# EAGLE design V1_HUB (EAGLE 6.4)
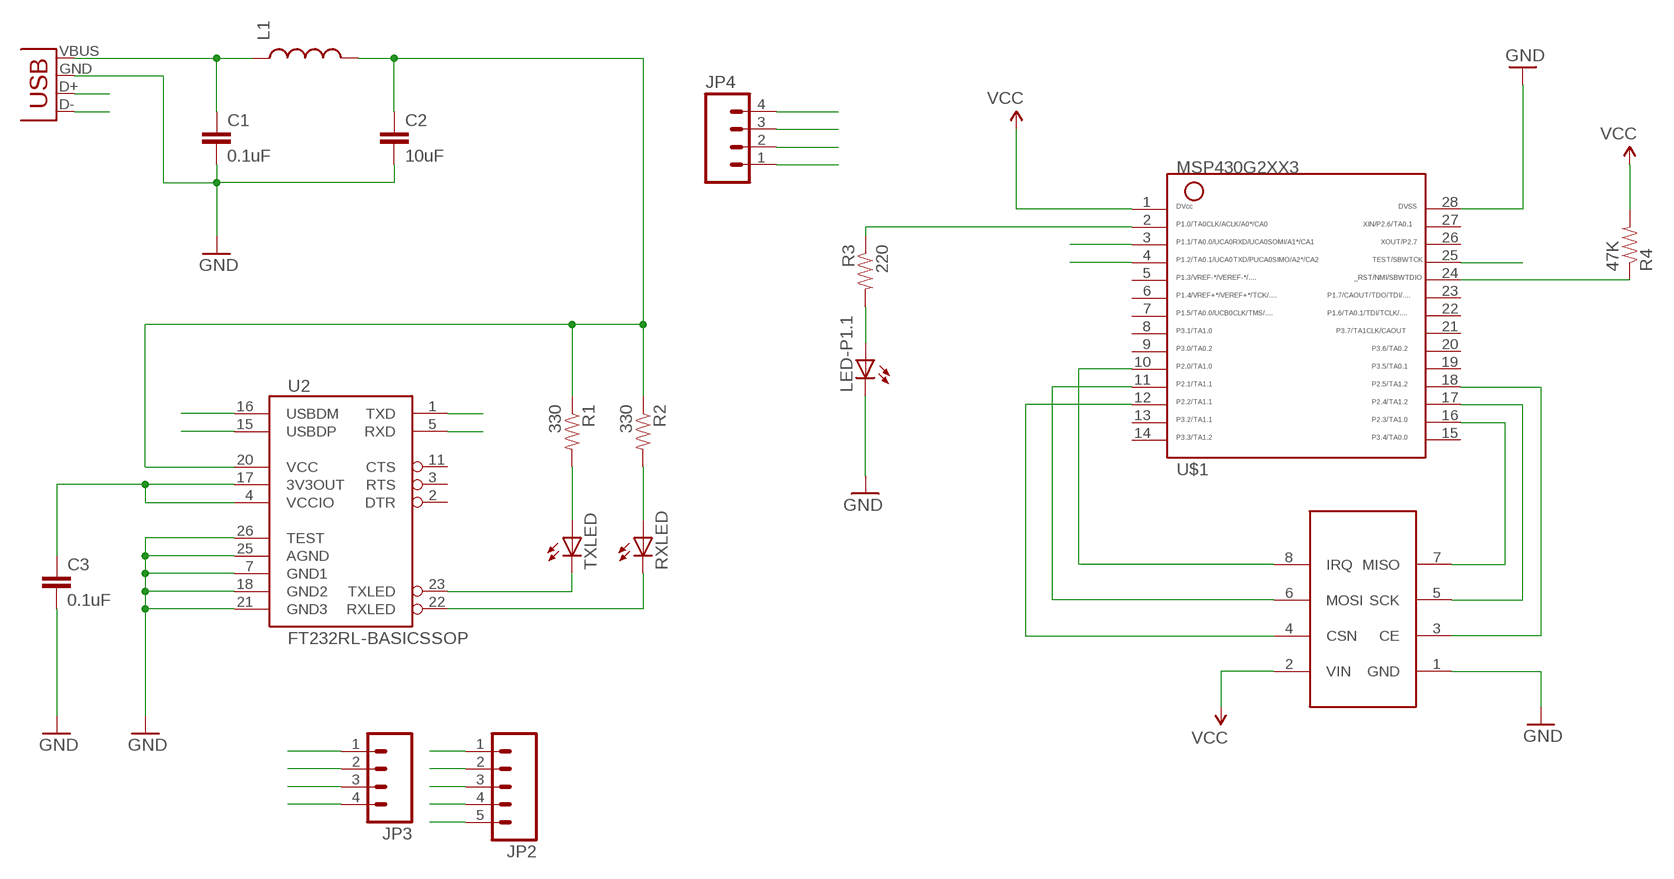
[diagram p0: schematic, sheet 1]

## Parts
C1  0.1uF  CAP0805  [0805]
C2  10uF  CAP0805  [0805]
C3  0.1uF  CAP0805  [0805]
JP1  USB-B  USB-A-H  [USB-A-H]
JP2  M05LOCK  [1X05_LOCK]
JP3  M04LOCK  [1X04_LOCK]
JP4  M04LOCK  [1X04_LOCK]
L1  INDUCTOR0805  [0805]
LED-P1.1  LED0805  [LED-0805]
R1  330  RESISTOR0805-RES  [0805]
R2  330  RESISTOR0805-RES  [0805]
R3  220  RESISTOR0805-RES  [0805]
R4  47K  RESISTOR0805-RES  [0805]
RXLED  LED0805  [LED-0805]
TXLED  LED0805  [LED-0805]
U1  NRF24L01-4X2  [NRF24L01-4X2]
U2  FT232RL-BASICSSOP  [SSOP28DB]
U$1  MSP430G2553  G2XX3---PW28  [PW28]

## Nets
5V: C2.1 JP2.5 L1.2 R1.1 R2.1 U2.20(VCC)
GND: C1.2 C2.2 C3.2 JP1.GND(VBUS) JP2.1 JP3.1 JP4.1 LED-P1.1.C U1.1(GND) U2.7(GND1) U2.18(GND2) U2.21(GND3) U2.25(AGND) U2.26(TEST) U$1.28
N$1: U1.3(CE) U$1.18
N$2: U1.5(SCK) U$1.17
N$3: U1.7(MISO) U$1.16
N$4: R3.1 U$1.2
N$5: U1.6(MOSI) U$1.11
N$6: U1.4(CSN) U$1.12
N$7: U1.8(IRQ) U$1.10
N$8: LED-P1.1.A R3.2
N$10: R1.2 TXLED.A
N$13: R2.2 RXLED.A
N$14: RXLED.C U2.22(RXLED)
N$15: TXLED.C U2.23(TXLED)
N$16: C1.1 JP1.VBUS(GND) L1.1
RESET: JP4.2 R4.1 U$1.24
RX: JP2.3 JP3.3 U2.5(RXD) U$1.4
TEST: JP4.3 U$1.25
TX: JP2.2 JP3.2 U2.1(TXD) U$1.3
USBDM: JP1.D-(D+) U2.16(USBDM)
USBDP: JP1.D+(D-) U2.15(USBDP)
VCC: C3.1 JP2.4 JP3.4 JP4.4 R4.2 U1.2(VIN) U2.4(VCCIO) U2.17(3V3OUT) U$1.1
Unconnected: U2.2(DTR) U2.3(RTS) U2.11(CTS) U$1.5 U$1.6 U$1.7 U$1.8 U$1.9 U$1.13 U$1.14 U$1.15 U$1.19 U$1.20 U$1.21 U$1.22 U$1.23 U$1.26 U$1.27

## Library data of the parts
C1-C3 = SparkFun-Capacitors:CAP: Capacitor Standard 0603 ceramic capacitor, and 0.1" leaded capacitor.
JP1 = SparkFun-Connectors:USB: USB Connectors USB-B-PTH is fully proven SKU : PRT-00139/CONN-08278 USB-miniB is fully proven SKU : PRT-00587 USB-A-PCB is untested. USB-A-H is throughly reviewed, but untested. Spark Fun Electronics SKU : PRT-00437 USB-B-SMT is throughly reviewed, but untested. Needs silkscreen touching up. USB-A-S has not been used/tested USB-MB-H has not been used/tested USB-MICROB has been used. CONN-09505
JP2 = SparkFun-Connectors:M05: Header 5 Standard 5-pin 0.1" header. Use with straight break away headers (SKU : PRT-00116), right angle break away headers (PRT-00553), swiss pins (PRT-00743), machine pins (PRT-00117), and female headers (PRT-00115). Molex polarized connector foot print use with SKU : PRT-08230 with associated crimp pins and housings.
JP3 JP4 = SparkFun-Connectors:M04: Header 4 Standard 4-pin 0.1" header. Use with straight break away headers (SKU : PRT-00116), right angle break away headers (PRT-00553), swiss pins (PRT-00743), machine pins (PRT-00117), and female headers (PRT-00115). Molex polarized connector foot print use with SKU : PRT-08231 with associated crimp pins and housings. 1MM SMD Version SKU: PRT-10208
L1 = SparkFun-Passives:INDUCTOR: Inductors Basic Inductor/Choke - 0603 and 1206. Footprints are not proven and vary greatly between part numbers.
LED-P1.1 RXLED TXLED = custom:LED: SMD LEDs 0603- DIO 0805- DIO 1206- DIO
R1 R2 = SparkFun-Passives:RESISTOR: Resistor Basic schematic elements and footprints for 0603, 1206, and PTH resistors.
R3 R4 = SparkFun-Resistors:RESISTOR: Resistor Basic schematic elements and footprints for 0603, 1206, and PTH resistors.
U1 = untitled:NRF24L01-4X2
U2 = SparkFun-DigitalIC:FT232RL-BASIC: USB UART This is the simplified version of the FT232RL unit. Only what you need, nothing you don't. Spark Fun Electronics SKU : COM-00650
U$1 = TI_MSP430_v16:G2XX3---PW28: MSP430G2XX1 TSSOP (PW) 28 Pin Package

## Board
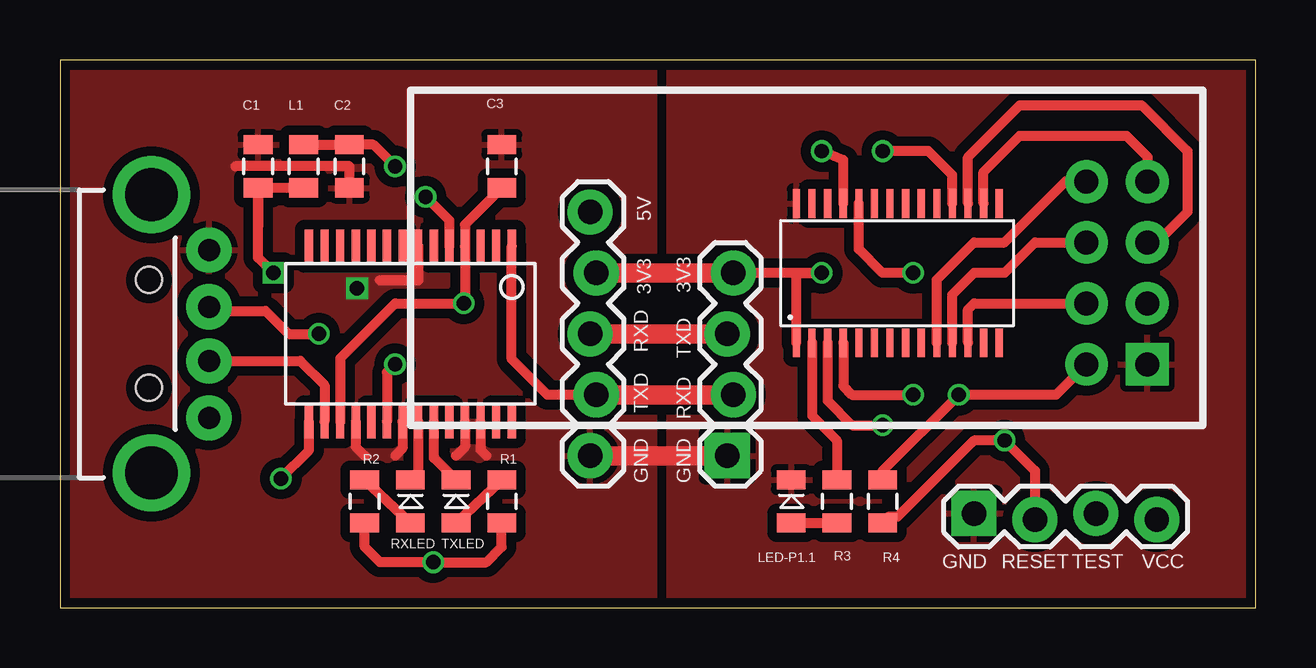
[diagram p1: board, top side]
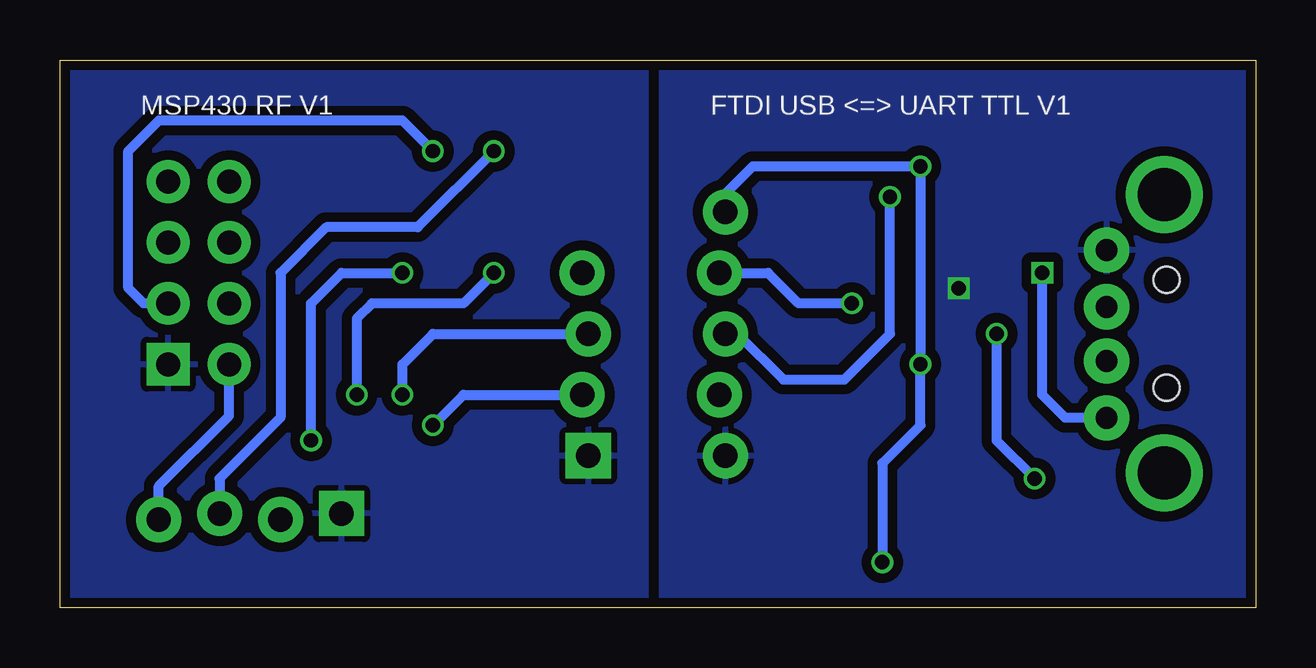
[diagram p2: board, bottom side, seen from below]

Size 49.84 x 22.85 mm. Coordinates in mm from the lower left corner, seen from the top.
Outline: 0,22.85 0,0 49.84,0 49.84,22.85 0,22.85
Copper layers (1*2*15*16): Top 0.035mm / dielectric 0.2mm / layer 2 0.0175mm / dielectric 1.1mm / layer 15 0.0175mm / dielectric 0.2mm / Bottom 0.035mm
Design rules "SeeedStudio_DRU_no_angle_20130527": minimum track width 6mil, minimum drill 12mil, track to track 6mil, track to pad 6mil, pad to pad 6mil, via to via 6mil, smd to smd 0mil, copper to edge 10mil, drill to drill 10mil, minimum pad ring 6mil, minimum via ring 6mil, stop-mask expansion 2mil, vias tented up to drill 25mil, thermal gap 10mil

### Footprints (pad centres in the part's own frame; a part is rotated, then mirrored left to right if it is on the bottom)
0805 = smd 0.8 x 1.2: 1 -0.9,0; 2 0.9,0
USB-A-H = drill 0.914 pad 1.88: D+ 2.4,1.127; D- 2.4,-1.127; GND 2.4,3.5; VBUS 2.4,-3.5 | drill 2.2: GND2 0,-5.8; GND3 0,5.8 | hole 1.1: -0.1,2.25; -0.1,-2.25
1X05_LOCK = drill 1.016 pad 1.88: 1 0,0.127; 2 2.54,-0.127; 3 5.08,0.127; 4 7.62,-0.127; 5 10.16,0.127
1X04_LOCK = drill 1.016 pad 1.88 square: 1 0,0.127 | drill 1.016 pad 1.88: 2 2.54,-0.127; 3 5.08,0.127; 4 7.62,-0.127
LED-0805 = smd 0.8 x 1.2: A -0.9,0; C 0.9,0
NRF24L01-4X2 = drill 1 pad 1.778 square: 1 -11.67,3.81 | drill 1 pad 1.778: 2 -9.13,3.81; 3 -11.67,1.27; 4 -9.13,1.27; 5 -11.67,-1.27; 6 -9.13,-1.27; 7 -11.67,-3.81; 8 -9.13,-3.81
SSOP28DB = smd 0.348 x 1.397: 1 -4.225,-3.656; 2 -3.575,-3.656; 3 -2.925,-3.656; 4 -2.275,-3.656; 5 -1.625,-3.656; 6 -0.975,-3.656; 7 -0.325,-3.656; 8 0.325,-3.656; 9 0.975,-3.656; 10 1.625,-3.656; 11 2.275,-3.656; 12 2.925,-3.656; 13 3.575,-3.656; 14 4.225,-3.656; 15 4.225,3.656; 16 3.575,3.656; 17 2.925,3.656; 18 2.275,3.656; 19 1.625,3.656; 20 0.975,3.656; 21 0.325,3.656; 22 -0.325,3.656; 23 -0.975,3.656; 24 -1.625,3.656; 25 -2.275,3.656; 26 -2.925,3.656; 27 -3.575,3.656; 28 -4.225,3.656
PW28 = smd 0.3 x 1.2: 1 -4.229,-2.908; 2 -3.579,-2.908; 3 -2.929,-2.908; 4 -2.279,-2.908; 5 -1.629,-2.908; 6 -0.979,-2.908; 7 -0.329,-2.908; 8 0.321,-2.908; 9 0.971,-2.908; 10 1.621,-2.908; 11 2.271,-2.908; 12 2.921,-2.908; 13 3.571,-2.908; 14 4.221,-2.908; 15 4.221,2.892; 16 3.571,2.892; 17 2.921,2.892; 18 2.271,2.892; 19 1.621,2.892; 20 0.971,2.892; 21 0.321,2.892; 22 -0.329,2.892; 23 -0.979,2.892; 24 -1.629,2.892; 25 -2.279,2.892; 26 -2.929,2.892; 27 -3.579,2.892; 28 -4.229,2.892

### Placement (x,y rotation side)
C1  8.26,18.41 90 top
C2  12.06,18.41 270 top
C3  18.41,18.41 90 top
JP1  3.81,11.43 0 top
JP2  22.23,6.35 90 top
JP3  27.94,6.35 90 top
JP4  38.1,3.81 0 top
L1  10.16,18.41 90 top
LED-P1.1  30.48,4.45 90 top
R1  18.41,4.45 90 top
R2  12.7,4.45 90 top
R3  32.38,4.45 270 top
R4  34.29,4.45 90 top
RXLED  14.61,4.45 90 top
TXLED  16.51,4.45 90 top
U1  33.66,13.97 180 top
U2  14.61,11.43 180 top
U$1  34.92,13.97 0 top

### Tracks (layer width: path | path; a pad name or v marks a point on that pad's centre or on a via)
5V  (via drill 0.6)
  Top 0.406: L1.2 C2.1 | C2.1 11.8,19.32 | v13.97,10.16 13.63,9.82 U2.20 | v13.97,18.41 13.07,19.32 C2.1 | R2.1 12.7,2.54 13.34,1.91 v15.56,1.91 17.78,1.91 18.41,2.54 R1.1
  Bottom 0.406: JP2.5 22.1,17.27 20.95,18.41 v13.97,18.41 v13.97,10.16 13.97,7.62 15.56,6.03 v15.56,1.91
GND  (via drill 0.6)
  Top 0.406: U2.18 12.33,6.72 12.7,6.35 | U2.21 14.28,6.66 13.97,6.35 | U2.26 17.53,6.6 17.78,6.35 | U2.25 16.88,6.72 16.51,6.35 | U2.7 14.93,13.65 13.34,13.65 | C2.2 12.06,18.41 7.3,18.41
  Top 0.813: JP2.1 JP3.1
  other vias: 12.38,13.34
  pour Bottom (isolate 0.406, rank 3): 0,0 0,22.86 24.77,22.86 24.77,0
  pour Top (isolate 0.406): 0,22.86 24.77,22.86 24.77,0 0,0
  pour Top (isolate 0.406): 49.53,0 25.4,0 25.4,22.86 49.53,22.86
  pour Bottom (isolate 0.406, rank 3): 49.53,0 25.4,0 25.4,22.86 49.53,22.86
N$1  (via drill 0.6)
  Top 0.406: U$1.18 37.2,18.05 36.2,19.05 v34.29,19.05
  Bottom 0.406: v34.29,19.05 35.56,20.32 45.72,20.32 46.99,19.05 46.99,13.34 46.35,12.7 U1.3
N$2
  Top 0.406: U$1.17 37.85,18.8 40.01,20.95 45.09,20.95 46.99,19.05 46.99,16.51 45.72,15.24 U1.5
N$3
  Top 0.406: U$1.16 38.5,18.18 40.01,19.68 44.45,19.68 45.33,18.81 U1.7
N$4
  Top 0.406: U$1.2 31.35,8.02 32.38,6.99 R3.1
N$5
  Top 0.406: U$1.11 37.2,13.07 38.1,13.97 39.37,13.97 40.64,15.24 U1.6
N$6
  Top 0.406: U$1.12 37.85,12.45 38.1,12.7 U1.4
N$7
  Top 0.406: U$1.10 36.55,13.69 38.1,15.24 39.37,15.24 41.91,17.78 U1.8
N$8
  Top 0.406: LED-P1.1.A R3.2
N$10
  Top 0.406: R1.2 TXLED.A
N$13
  Top 0.406: RXLED.A R2.2
N$14
  Top 0.406: U2.22 14.93,5.67 RXLED.C
N$15
  Top 0.406: U2.23 15.58,6.24 15.62,6.24 TXLED.C
N$16  (via drill 0.6)
  Top 0.406: L1.1 C1.1 | C1.1 8.26,15.88 | v8.89,13.97 8.26,14.61 C1.1
  Bottom 0.406: JP1.VBUS 7.93,7.93 8.89,8.89 v8.89,13.97
RESET  (via drill 0.6)
  Top 0.406: v35.56,13.97 34.29,13.97 33.3,14.96 U$1.24 | 34.66,3.54 R4.1 34.55,3.81 34.92,3.81 38.1,6.99 v39.37,6.99 40.64,5.71 JP4.2
  Bottom 0.406: v39.37,6.99 39.37,12.7 38.1,13.97 v35.56,13.97
RX  (via drill 0.6)
  Top 0.406: U$1.4 32.65,9.26 33.02,8.89 v35.56,8.89 | U2.5 16.23,16.16 v15.24,17.14
  Top 0.813: JP3.3 JP2.3
  Bottom 0.406: v35.56,8.89 35.56,10.16 34.29,11.43 JP3.3 | v15.24,17.14 15.24,11.43 17.14,9.53 19.68,9.53 21.59,11.43 JP2.3
TEST  (via drill 0.6)
  Top 0.406: U$1.25 32.65,18.68 v31.75,19.05
  Bottom 0.406: v31.75,19.05 34.92,15.88 38.73,15.88 40.64,13.97 40.64,7.94 43.18,5.4 JP4.3
TX  (via drill 0.6)
  Top 0.406: U$1.3 32,8.64 33.02,7.62 v34.29,7.62 | JP2.2 20.32,8.89 18.83,10.38 U2.1
  Top 0.813: JP2.2 JP3.2
  Bottom 0.406: v34.29,7.62 33.02,8.89 JP3.2
USBDM
  Top 0.406: U2.16 11.03,9.29 10.02,10.3 JP1.D-
USBDP  (via drill 0.6)
  Top 0.406: v9.21,5.4 10.38,6.57 U2.15 | JP1.D+ 6.38,12.38 8.57,12.38 9.53,11.43 v10.79,11.43
  Bottom 0.406: v10.79,11.43 10.79,6.99 v9.21,5.4
VCC  (via drill 0.6)
  Top 0.406: v16.83,12.7 13.97,12.7 11.68,10.41 U2.17 | v16.83,12.7 16.88,12.7 | 27.79,13.97 JP3.4 v31.75,13.97 30.7,13.97 U$1.1 | U1.2 41.52,8.89 v37.47,8.89 34.29,5.71 R4.2 | C3.1 16.88,15.98 U2.4 16.88,12.75 v16.83,12.7
  Top 0.813: JP2.4 JP3.4
  Bottom 0.406: v31.75,13.97 33.02,12.7 36.83,12.7 37.47,12.06 v37.47,8.89 | JP2.4 20.32,13.97 19.05,12.7 v16.83,12.7 | JP4.4 45.72,5.08 42.78,8.02 U1.2

### Text on the board
tPlace: 5V | 3V3 | 3V3 | RXD | TXD | TXD | RXD | GND | GND | GND | RESET | TEST | VCC
bPlace: FTDI USB <=> UART TTL V1 | MSP430 RF V1